# EAGLE schematic motherboard (EAGLE 8.2.2)

## Sheet 1 of 3
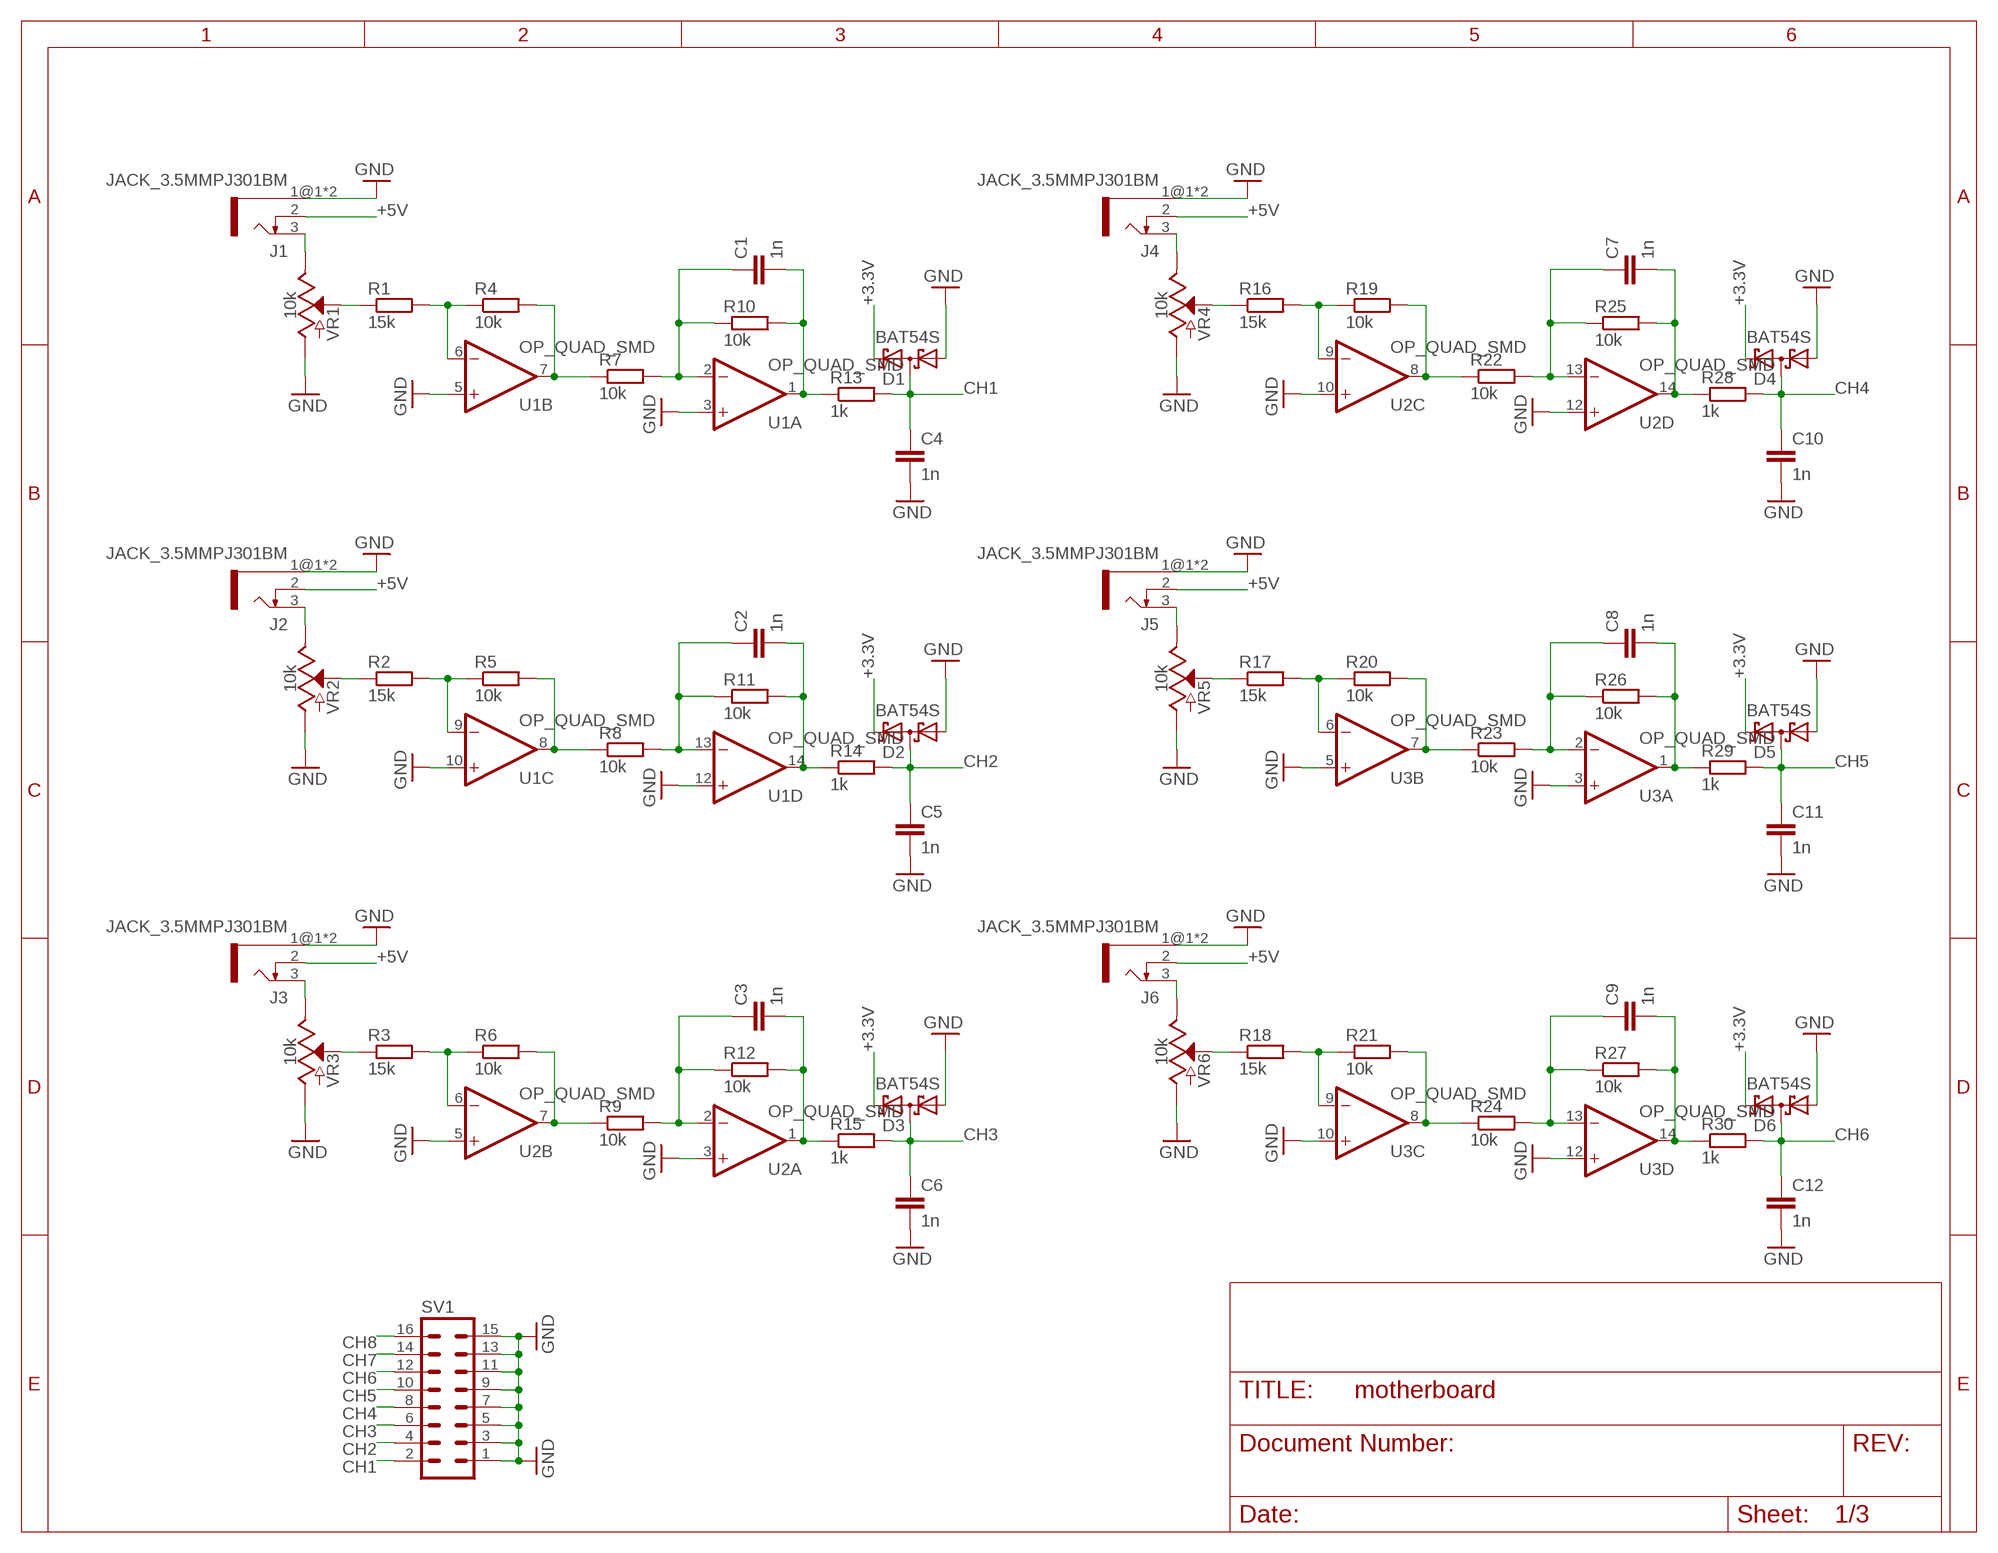
[diagram p0: schematic, sheet 1]

### Parts
C1  1n  CC0603  [C0603]
C2  1n  CC0603  [C0603]
C3  1n  CC0603  [C0603]
C4  1n  CC0603  [C0603]
C5  1n  CC0603  [C0603]
C6  1n  CC0603  [C0603]
C7  1n  CC0603  [C0603]
C8  1n  CC0603  [C0603]
C9  1n  CC0603  [C0603]
C10  1n  CC0603  [C0603]
C11  1n  CC0603  [C0603]
C12  1n  CC0603  [C0603]
D1  BAT54S  [SOT23]
D2  BAT54S  [SOT23]
D3  BAT54S  [SOT23]
D4  BAT54S  [SOT23]
D5  BAT54S  [SOT23]
D6  BAT54S  [SOT23]
J1  JACK_3.5MMPJ301BM  [PJ301BM_JACK]
J2  JACK_3.5MMPJ301BM  [PJ301BM_JACK]
J3  JACK_3.5MMPJ301BM  [PJ301BM_JACK]
J4  JACK_3.5MMPJ301BM  [PJ301BM_JACK]
J5  JACK_3.5MMPJ301BM  [PJ301BM_JACK]
J6  JACK_3.5MMPJ301BM  [PJ301BM_JACK]
R1  15k  RR0603  [R0603]
R2  15k  RR0603  [R0603]
R3  15k  RR0603  [R0603]
R4  10k  RR0603  [R0603]
R5  10k  RR0603  [R0603]
R6  10k  RR0603  [R0603]
R7  10k  RR0603  [R0603]
R8  10k  RR0603  [R0603]
R9  10k  RR0603  [R0603]
R10  10k  RR0603  [R0603]
R11  10k  RR0603  [R0603]
R12  10k  RR0603  [R0603]
R13  1k  RR0603  [R0603]
R14  1k  RR0603  [R0603]
R15  1k  RR0603  [R0603]
R16  15k  RR0603  [R0603]
R17  15k  RR0603  [R0603]
R18  15k  RR0603  [R0603]
R19  10k  RR0603  [R0603]
R20  10k  RR0603  [R0603]
R21  10k  RR0603  [R0603]
R22  10k  RR0603  [R0603]
R23  10k  RR0603  [R0603]
R24  10k  RR0603  [R0603]
R25  10k  RR0603  [R0603]
R26  10k  RR0603  [R0603]
R27  10k  RR0603  [R0603]
R28  1k  RR0603  [R0603]
R29  1k  RR0603  [R0603]
R30  1k  RR0603  [R0603]
SV1  MA08-2  [MA08-2]
U1  OP_QUAD_SMD  [SO14]
U2  OP_QUAD_SMD  [SO14]
U3  OP_QUAD_SMD  [SO14]
VR1  10k  POTENTIOMETER-PTH-9MM-1/20W-20%-KIT  [POT-PTH-ALPS-KIT]
VR2  10k  POTENTIOMETER-PTH-9MM-1/20W-20%-KIT  [POT-PTH-ALPS-KIT]
VR3  10k  POTENTIOMETER-PTH-9MM-1/20W-20%-KIT  [POT-PTH-ALPS-KIT]
VR4  10k  POTENTIOMETER-PTH-9MM-1/20W-20%-KIT  [POT-PTH-ALPS-KIT]
VR5  10k  POTENTIOMETER-PTH-9MM-1/20W-20%-KIT  [POT-PTH-ALPS-KIT]
VR6  10k  POTENTIOMETER-PTH-9MM-1/20W-20%-KIT  [POT-PTH-ALPS-KIT]

### Nets
+3.3V [power]: D1.2(C2) D2.2(C2) D3.2(C2) D4.2(C2) D5.2(C2) D6.2(C2) ; also sheet 3
+5V: J1.2 J2.2 J3.2 J4.2 J5.2 J6.2 ; also sheet 2,3
CH1: C4.1 D1.3(C1A2) R13.2 SV1.2
CH2: C5.1 D2.3(C1A2) R14.2 SV1.4
CH3: C6.1 D3.3(C1A2) R15.2 SV1.6
CH4: C10.1 D4.3(C1A2) R28.2 SV1.8
CH5: C11.1 D5.3(C1A2) R29.2 SV1.10
CH6: C12.1 D6.3(C1A2) R30.2 SV1.12
CH7: SV1.14
CH8: SV1.16
GND [ground]: C4.2 C5.2 C6.2 C10.2 C11.2 C12.2 D1.1(A1) D2.1(A1) D3.1(A1) D4.1(A1) D5.1(A1) D6.1(A1) J1.1@1 J1.1@2 J2.1@1 J2.1@2 J3.1@1 J3.1@2 J4.1@1 J4.1@2 J5.1@1 J5.1@2 J6.1@1 J6.1@2 SV1.1 SV1.3 SV1.5 SV1.7 SV1.9 SV1.11 SV1.13 SV1.15 U1.3(A:+IN) U1.5(B:+IN) U1.10(C:+IN) U1.12(D:+IN) U2.3(A:+IN) U2.5(B:+IN) U2.10(C:+IN) U2.12(D:+IN) U3.3(A:+IN) U3.5(B:+IN) U3.10(C:+IN) U3.12(D:+IN) VR1.P$1(A) VR2.P$1(A) VR3.P$1(A) VR4.P$1(A) VR5.P$1(A) VR6.P$1(A) ; also sheet 2,3
N$1: R2.1 VR2.P$2(S)
N$2: J2.3 VR2.P$3(E)
N$3: R1.2 R4.1 U1.6(B:-IN)
N$4: R4.2 R7.1 U1.7(B:OUT)
N$5: C1.1 R7.2 R10.1 U1.2(A:-IN)
N$6: C1.2 R10.2 R13.1 U1.1(A:OUT)
N$7: R1.1 VR1.P$2(S)
N$8: R2.2 R5.1 U1.9(C:-IN)
N$9: R5.2 R8.1 U1.8(C:OUT)
N$10: J1.3 VR1.P$3(E)
N$11: C2.1 R8.2 R11.1 U1.13(D:-IN)
N$12: C2.2 R11.2 R14.1 U1.14(D:OUT)
N$19: R16.2 R19.1 U2.9(C:-IN)
N$20: R19.2 R22.1 U2.8(C:OUT)
N$21: C7.1 R22.2 R25.1 U2.13(D:-IN)
N$22: C7.2 R25.2 R28.1 U2.14(D:OUT)
N$23: R16.1 VR4.P$2(S)
N$24: J4.3 VR4.P$3(E)
N$25: R3.2 R6.1 U2.6(B:-IN)
N$26: R6.2 R9.1 U2.7(B:OUT)
N$27: C3.1 R9.2 R12.1 U2.2(A:-IN)
N$28: C3.2 R12.2 R15.1 U2.1(A:OUT)
N$31: R3.1 VR3.P$2(S)
N$32: J3.3 VR3.P$3(E)
N$33: R18.2 R21.1 U3.9(C:-IN)
N$34: R21.2 R24.1 U3.8(C:OUT)
N$35: C9.1 R24.2 R27.1 U3.13(D:-IN)
N$36: C9.2 R27.2 R30.1 U3.14(D:OUT)
N$37: R18.1 VR6.P$2(S)
N$38: J6.3 VR6.P$3(E)
N$39: R17.2 R20.1 U3.6(B:-IN)
N$40: R20.2 R23.1 U3.7(B:OUT)
N$41: C8.1 R23.2 R26.1 U3.2(A:-IN)
N$42: C8.2 R26.2 R29.1 U3.1(A:OUT)
N$43: R17.1 VR5.P$2(S)
N$44: J5.3 VR5.P$3(E)

## Sheet 2 of 3
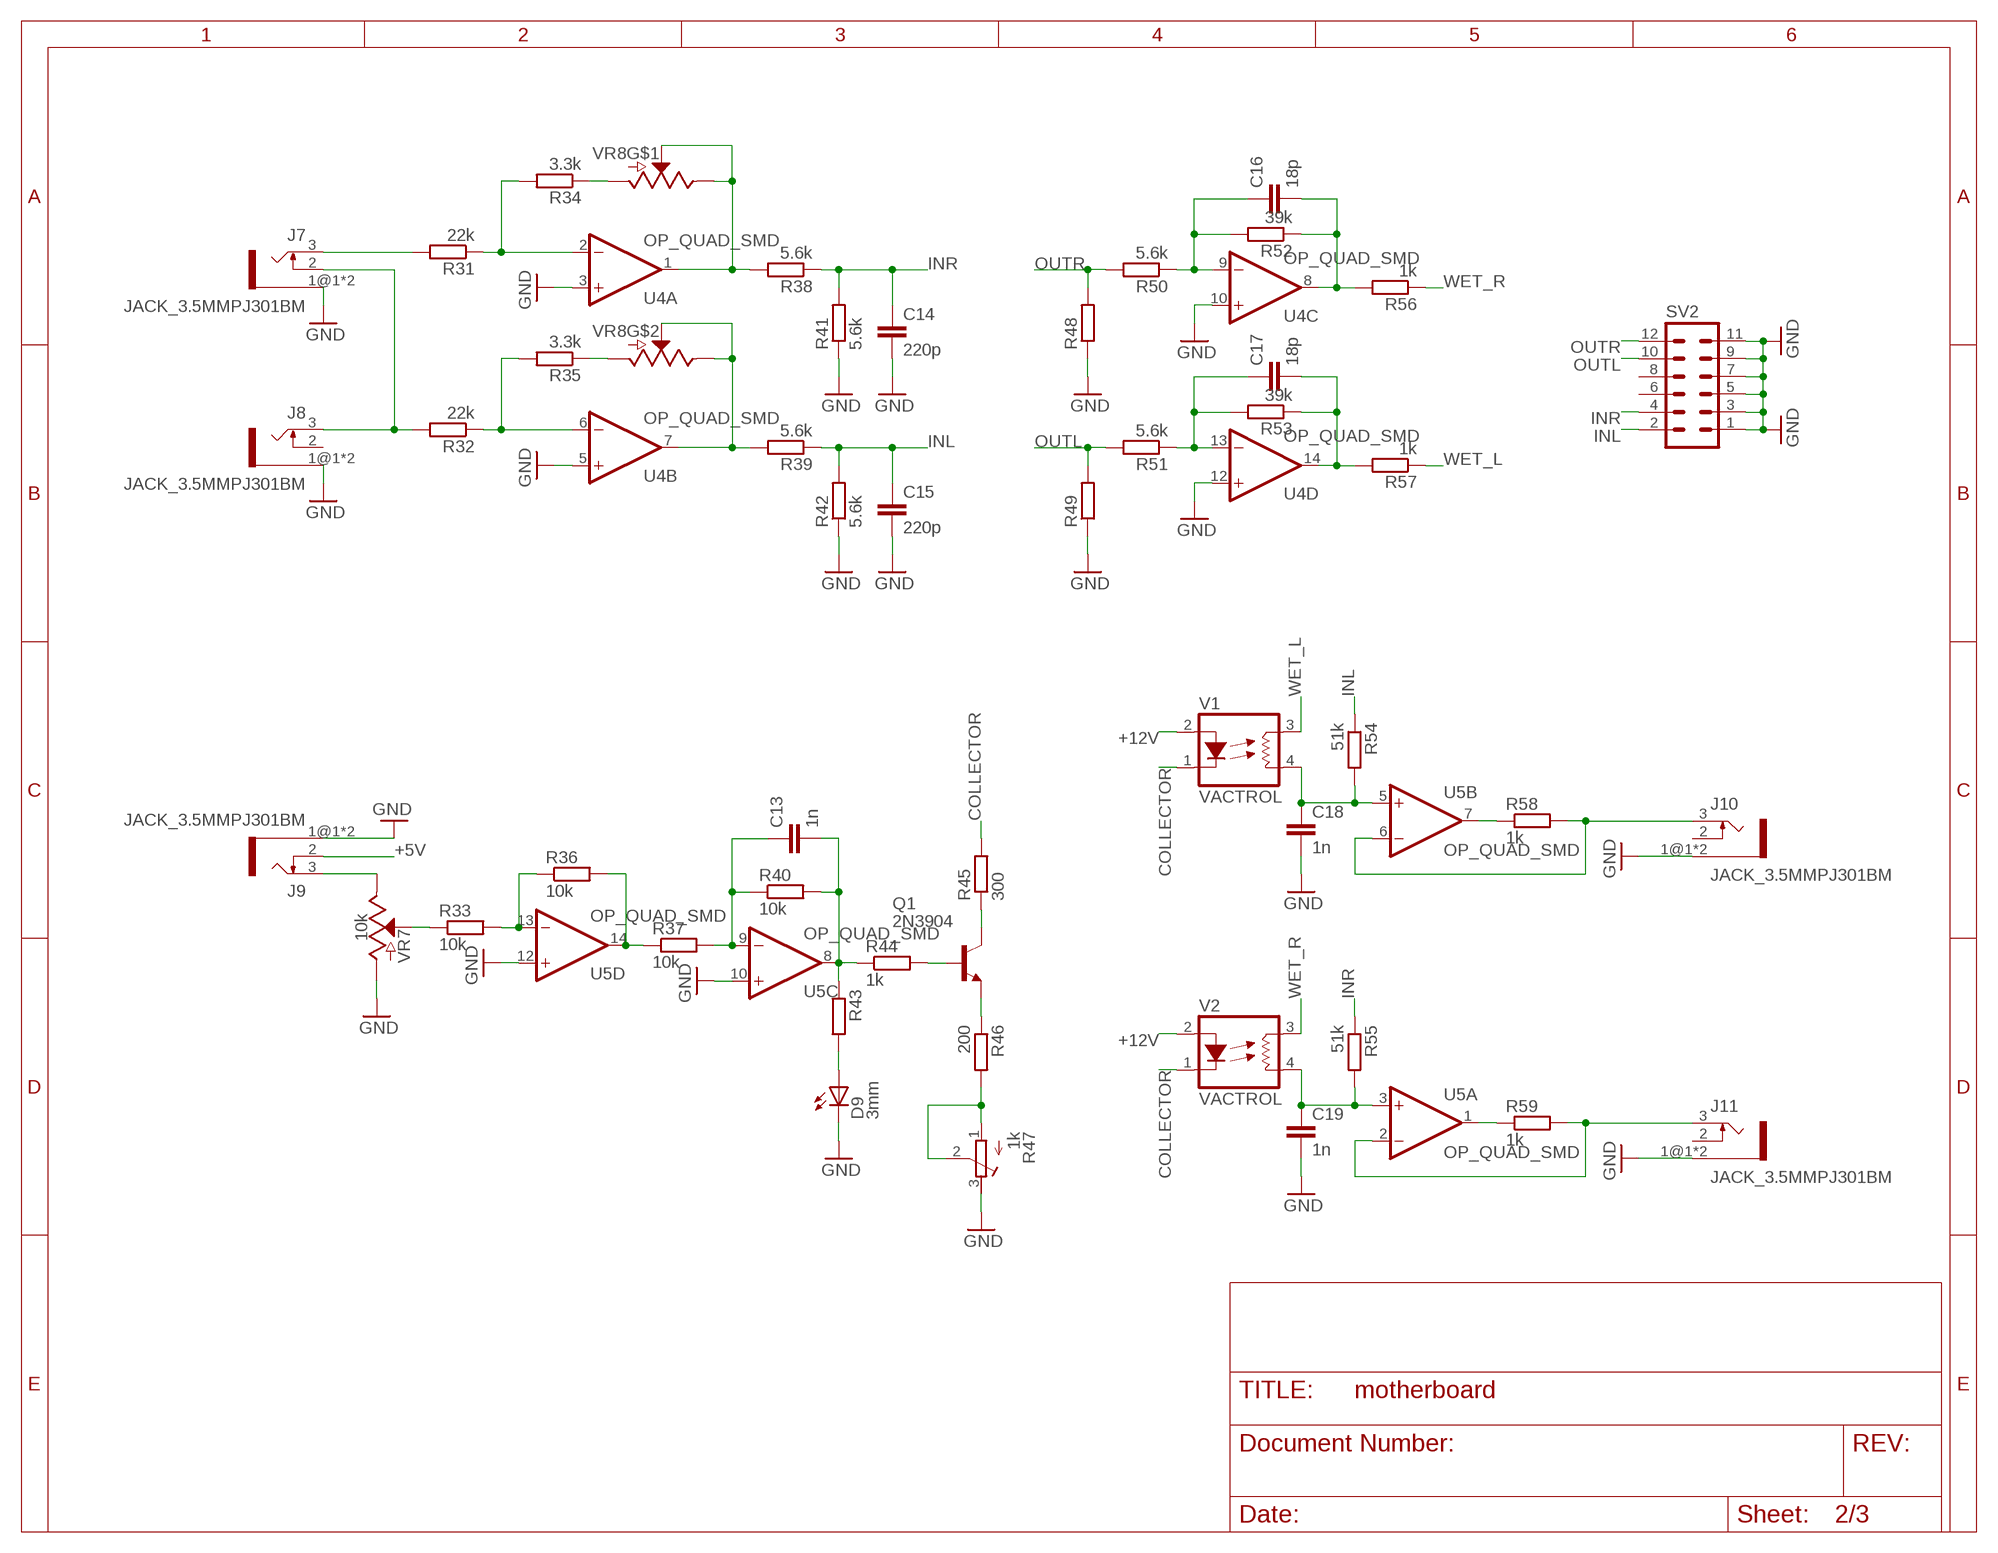
[diagram p1: schematic, sheet 2]

### Parts
C13  1n  CC0603  [C0603]
C14  220p  CC0603  [C0603]
C15  220p  CC0603  [C0603]
C16  18p  CC0603  [C0603]
C17  18p  CC0603  [C0603]
C18  1n  CC0603  [C0603]
C19  1n  CC0603  [C0603]
D9  3mm  LED3MM  [LED3MM]
J7  JACK_3.5MMPJ301BM  [PJ301BM_JACK]
J8  JACK_3.5MMPJ301BM  [PJ301BM_JACK]
J9  JACK_3.5MMPJ301BM  [PJ301BM_JACK]
J10  JACK_3.5MMPJ301BM  [PJ301BM_JACK]
J11  JACK_3.5MMPJ301BM  [PJ301BM_JACK]
Q1  2N3904  [TO92]
R31  22k  RR0603  [R0603]
R32  22k  RR0603  [R0603]
R33  10k  RR0603  [R0603]
R34  3.3k  RR0603  [R0603]
R35  3.3k  RR0603  [R0603]
R36  10k  RR0603  [R0603]
R37  10k  RR0603  [R0603]
R38  5.6k  RR0603  [R0603]
R39  5.6k  RR0603  [R0603]
R40  10k  RR0603  [R0603]
R41  5.6k  RR0603  [R0603]
R42  5.6k  RR0603  [R0603]
R43  RESISTOR10MM  [1/4W_RESISTOR]
R44  1k  RR0603  [R0603]
R45  300  RESISTOR10MM  [1/4W_RESISTOR]
R46  200  RR0603  [R0603]
R47  1k  R-TRIMM64W  [RTRIM64W]
R48  RR0603  [R0603]
R49  RR0603  [R0603]
R50  5.6k  RR0603  [R0603]
R51  5.6k  RR0603  [R0603]
R52  39k  RR0603  [R0603]
R53  39k  RR0603  [R0603]
R54  51k  RR0603  [R0603]
R55  51k  RR0603  [R0603]
R56  1k  RR0603  [R0603]
R57  1k  RR0603  [R0603]
R58  1k  RR0603  [R0603]
R59  1k  RR0603  [R0603]
SV2  MA06-2  [MA06-2]
U4  OP_QUAD_SMD  [SO14]
U5  OP_QUAD_SMD  [SO14]
V1  VACTROL  [VACTROL_4PIN_VTL5C]
V2  VACTROL  [VACTROL_4PIN_VTL5C]
VR7  10k  POTENTIOMETER-PTH-9MM-1/20W-20%-KIT  [POT-PTH-ALPS-KIT]
VR8  POTENTIOMETER_DUAL-PTH-12MM-1/20W-20%-KIT  [POT-DUAL-PTH-PANASONIC-VERT-KIT]

### Nets
+5V: J9.2 ; also sheet 1,3
+12V [power]: V1.2(LED+) V2.2(LED+) ; also sheet 3
COLLECTOR: R45.2 V1.1(LED-) V2.1(LED-)
GND [ground]: C14.2 C15.2 C18.2 C19.2 D9.K(C) J7.1@1 J7.1@2 J8.1@1 J8.1@2 J9.1@1 J9.1@2 J10.1@1 J10.1@2 J11.1@1 J11.1@2 R41.1 R42.1 R47.3(A) R48.1 R49.1 SV2.1 SV2.3 SV2.5 SV2.7 SV2.9 SV2.11 U4.3(A:+IN) U4.5(B:+IN) U4.10(C:+IN) U4.12(D:+IN) U5.10(C:+IN) U5.12(D:+IN) VR7.P$1(A) ; also sheet 1,3
INL: C15.1 R39.1 R42.2 R54.1 SV2.2
INR: C14.1 R38.1 R41.2 R55.1 SV2.4
N$13: J9.3 VR7.P$3(E)
N$14: C13.2 R40.2 R43.1 R44.1 U5.8(C:OUT)
N$15: R33.1 VR7.P$2(S)
N$16: R33.2 R36.1 U5.13(D:-IN)
N$17: R36.2 R37.1 U5.14(D:OUT)
N$18: C13.1 R37.2 R40.1 U5.9(C:-IN)
N$29: D9.A R43.2
N$30: J10.3 R58.2 U5.6(B:-IN)
N$45: R58.1 U5.7(B:OUT)
N$46: C18.1 R54.2 U5.5(B:+IN) V1.4(RES2)
N$47: Q1.3(E) R46.1
N$48: R46.2 R47.1(E) R47.2(S)
N$49: Q1.1(C) R45.1
N$51: R34.1 VR8.A1(A)
N$52: Q1.2(B) R44.2
N$53: J11.3 R59.2 U5.2(A:-IN)
N$54: R59.1 U5.1(A:OUT)
N$55: C19.1 R55.2 U5.3(A:+IN) V2.4(RES2)
N$56: R35.1 VR8.B1(A)
N$61 [ground]: J7.2 J8.3 R32.2
N$62: J7.3 R31.2
N$69: C17.1 R51.1 R53.2 U4.13(D:-IN)
N$70: C17.2 R53.1 R57.2 U4.14(D:OUT)
N$72: C16.1 R50.1 R52.2 U4.9(C:-IN)
N$73: C16.2 R52.1 R56.2 U4.8(C:OUT)
N$74: R38.2 U4.1(A:OUT) VR8.A2(S) VR8.A3(E)
N$75: R39.2 U4.7(B:OUT) VR8.B2(S) VR8.B3(E)
N$78: R31.1 R34.2 U4.2(A:-IN)
N$79: R32.1 R35.2 U4.6(B:-IN)
OUTL: R49.2 R51.2 SV2.10
OUTR: R48.2 R50.2 SV2.12
WET_L: R57.1 V1.3(RES1)
WET_R: R56.1 V2.3(RES1)
Unconnected: J8.2 J10.2 J11.2 SV2.6 SV2.8

## Sheet 3 of 3
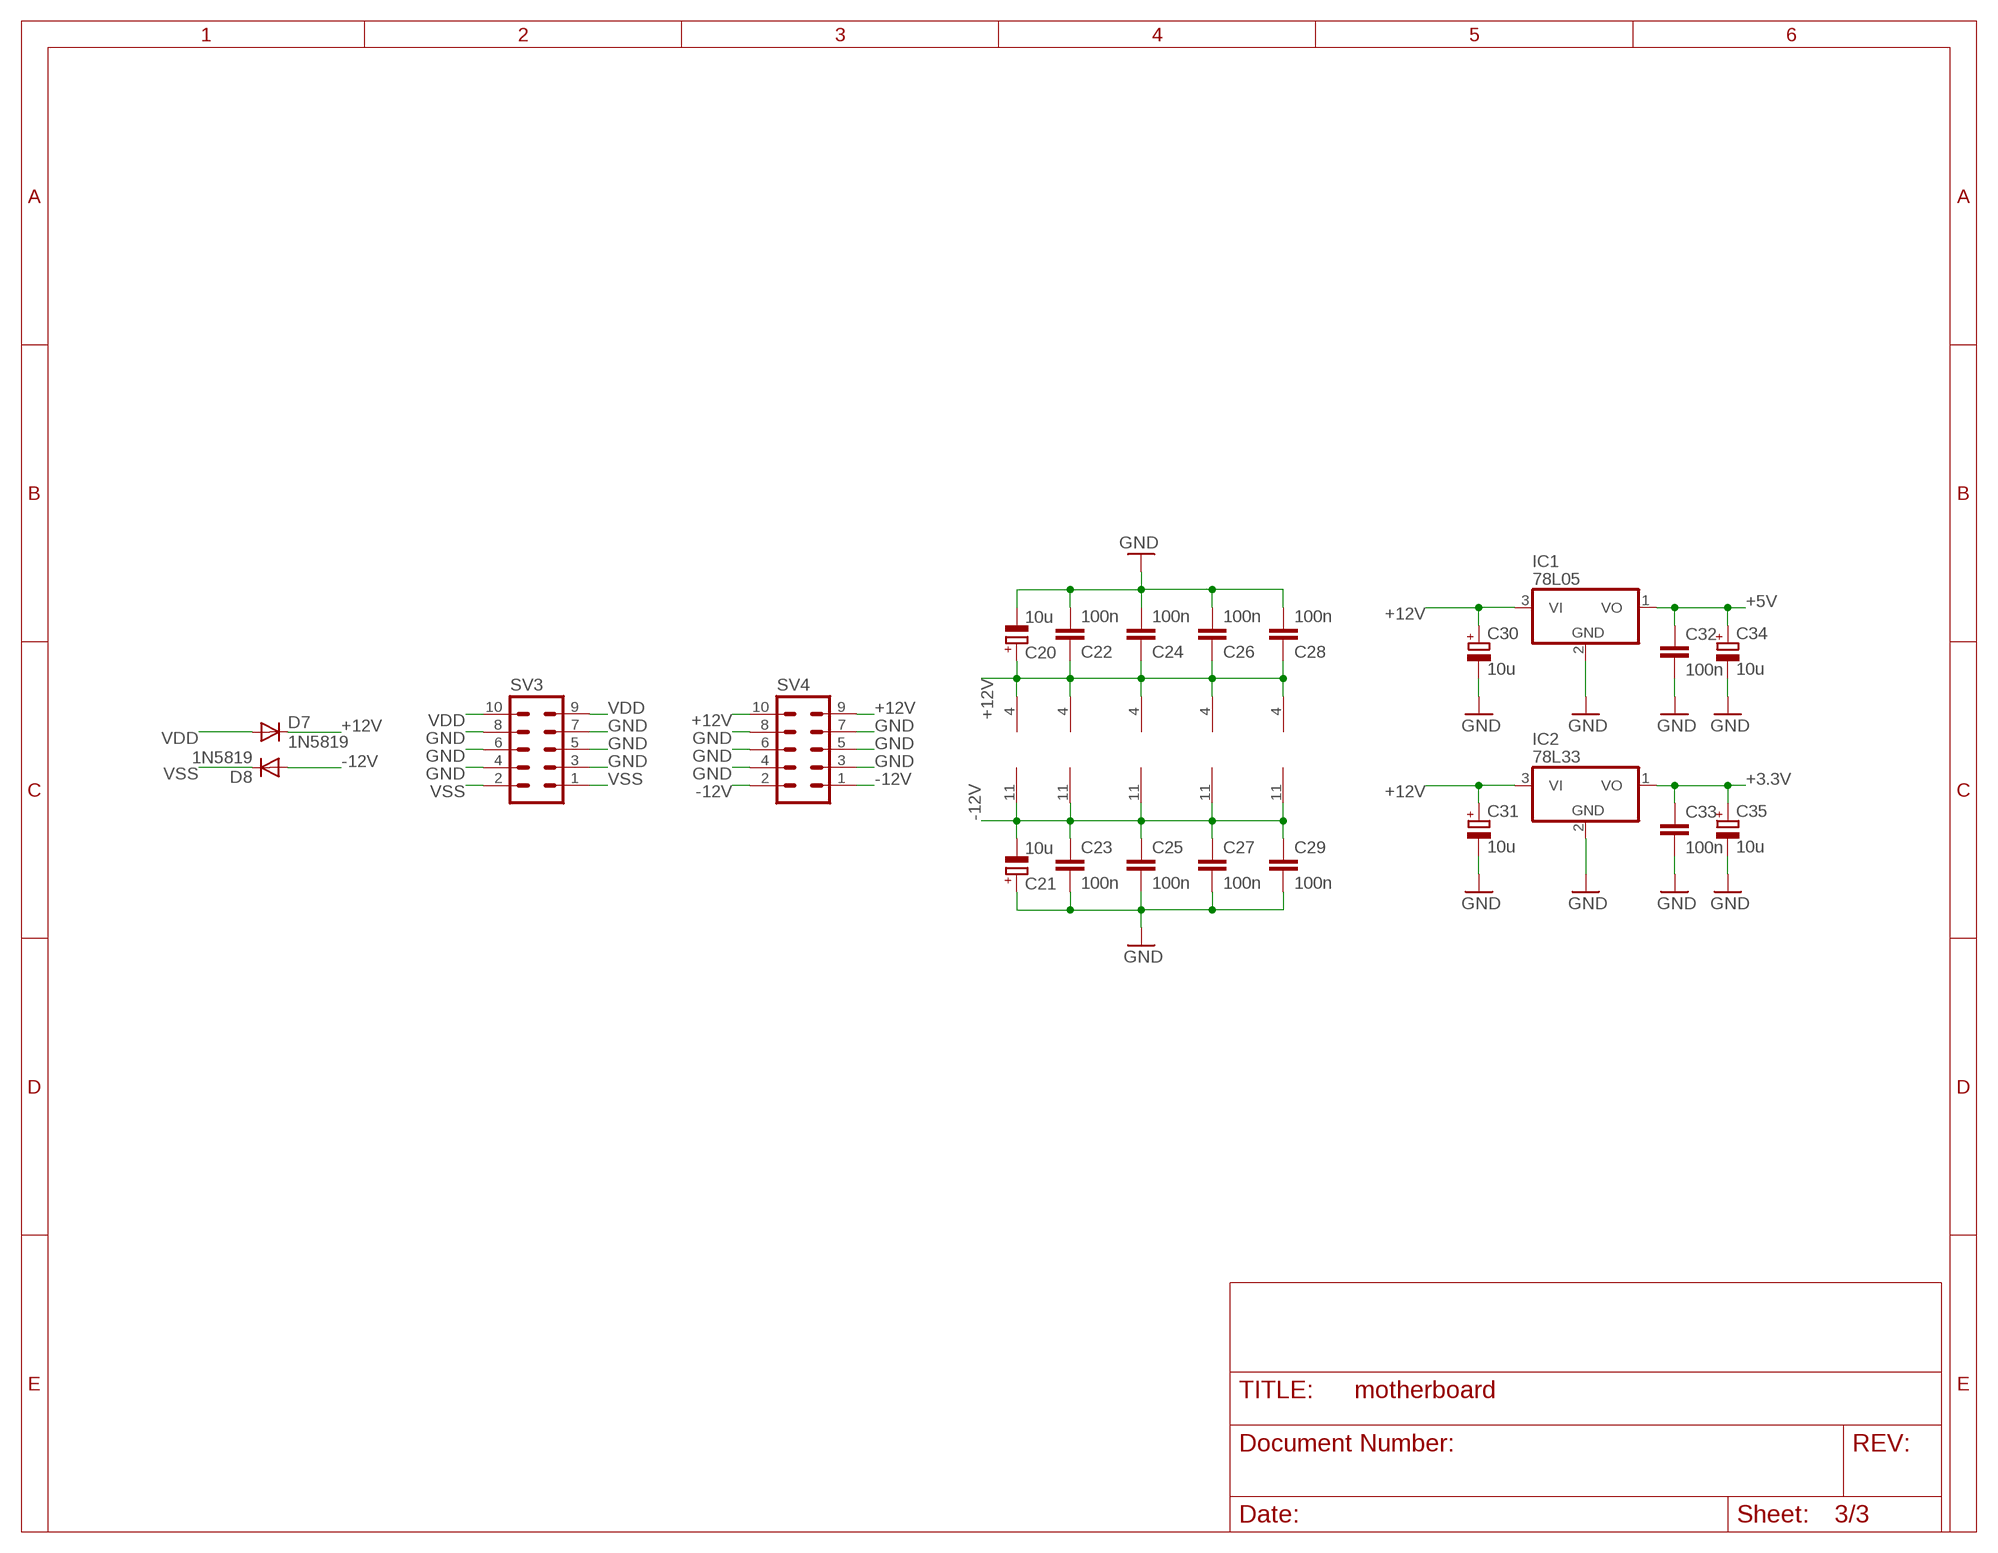
[diagram p2: schematic, sheet 3]

### Parts
C20  10u  CPOL-EUE2.5-6  [E2,5-6]
C21  10u  CPOL-EUE2.5-6  [E2,5-6]
C22  100n  C5/3.5  [C5B3.5]
C23  100n  C5/3.5  [C5B3.5]
C24  100n  C5/3.5  [C5B3.5]
C25  100n  C5/3.5  [C5B3.5]
C26  100n  C5/3.5  [C5B3.5]
C27  100n  C5/3.5  [C5B3.5]
C28  100n  C5/3.5  [C5B3.5]
C29  100n  C5/3.5  [C5B3.5]
C30  10u  CPOL-EUE2.5-6  [E2,5-6]
C31  10u  CPOL-EUE2.5-6  [E2,5-6]
C32  100n  C5/3.5  [C5B3.5]
C33  100n  C5/3.5  [C5B3.5]
C34  10u  CPOL-EUE2.5-6  [E2,5-6]
C35  10u  CPOL-EUE2.5-6  [E2,5-6]
D7  1N5819  CGRM4001-G  [SOD-123_MINI-SMA]
D8  1N5819  CGRM4001-G  [SOD-123_MINI-SMA]
IC1  78L05  78L05Z  [TO92]
IC2  78L33  78L05Z  [TO92]
SV3  MA05-2  [MA05-2]
SV4  MA05-2  [MA05-2]

### Nets
+3.3V [power]: C33.1 C35.+ IC2.1(VO) ; also sheet 1
+5V: C32.1 C34.+ IC1.1(VO) ; also sheet 1,2
+12V [power]: C20.+ C22.1 C24.1 C26.1 C28.1 C30.+ C31.+ D7.C IC1.3(VI) IC2.3(VI) SV4.9 SV4.10 U1.4(P:V+) U2.4(P:V+) U3.4(P:V+) U4.4(P:V+) U5.4(P:V+) ; also sheet 2
-12V: C21.- C23.1 C25.1 C27.1 C29.1 D8.A SV4.1 SV4.2 U1.11(P:V-) U2.11(P:V-) U3.11(P:V-) U4.11(P:V-) U5.11(P:V-)
GND [ground]: C20.- C21.+ C22.2 C23.2 C24.2 C25.2 C26.2 C27.2 C28.2 C29.2 C30.- C31.- C32.2 C33.2 C34.- C35.- IC1.2(GND) IC2.2(GND) SV3.3 SV3.4 SV3.5 SV3.6 SV3.7 SV3.8 SV4.3 SV4.4 SV4.5 SV4.6 SV4.7 SV4.8 ; also sheet 1,2
VDD [power]: D7.A SV3.9 SV3.10
VSS [power]: D8.C SV3.1 SV3.2

## Library data of the parts
C1-C19 = eagle-ltspice:C: CAPACITOR, European symbol; SPICEMODEL: NONE; SPICEPREFIX: C
C20 C21 C30 C31 C34 C35 = rcl:CPOL-EU: POLARIZED CAPACITOR, European symbol
C22-C29 C32 C33 = capacitor-wima:C: CAPACITOR naming: grid - package width
D1-D6 = diode:BAT54S: Schottky Diodes Pin connection corrected 2011-05-04 Source: Fairchild .. BAT54.pdf
D7 D8 = diode:CGRM400*-G: Molded plasitc,JEDEC SOD-123/Mini SMA Source: Comchip CGRM4001-G.pdf
D9 = led:LED: LED OSRAM: - CHIPLED LG R971, LG N971, LY N971, LG Q971, LY Q971, LO R971, LY R971 LH N974, LH R974 LS Q976, LO Q976, LY Q976 LO Q996 - Hyper CHIPLED LW Q18S LB Q993, LB Q99A, LB R99A - SideLED LS A670, LO A670, LY A670, LG A670, LP A670 LB A673, LV A673, LT A673, LW A673 LH A674 LY A675 LS A676, LA A676, LO A676, LY A676, LW A676 LS A679, LY A679, LG A679 - Hyper Micro SIDELED® LS Y876, LA Y876, LO Y876, LY Y876 LT Y87S - SmartLED LW L88C, LW L88S LB L89C, LB L89S, LG L890 LS L89K, LO L89K, LY L89K LS L896, LA L896, LO L896, LY L896 - TOPLED LS T670, LO T670, LY T670, LG T670, LP T670 LSG T670, LSP T670, LSY T670, LOP T670, LYG T670 LG T671, LOG T671, LSG T671 LB T673, LV T673, LT T673, LW T673 LH T674 LS T676, LA T676, LO T676, LY T676, LB T676, LH T676, LSB T676, LW T676 LB T67C, LV T67C, LT T67C, LS T67K, LO T67K, LY T67K, LW E67C LS E67B, LA E67B, LO E67B, LY E67B, LB E67C, LV E67C, LT E67C LW T67C LS T679, LY T679, LG T679 LS T770, LO T770, LY T770, LG T770, LP T770 LB T773, LV T773, LT T773, LW T773 LH T774 LS E675, LA E675, LY E675, LS T675 LS T776, LA T776, LO T776, LY T776, LB T776 LHGB T686 LT T68C, LB T68C - Hyper Mini TOPLED® LB M676 - Mini TOPLED Santana® LG M470 LS M47K, LO M47K, LY M47K Source: http://www.osram.convergy.de LUXEON: - LUMILED® LXK2-PW12-R00, LXK2-PW12-S00, LXK2-PW14-U00, LXK2-PW14-V00 LXK2-PM12-R00, LXK2-PM12-S00, LXK2-PM14-U00 LXK2-PE12-Q00, LXK2-PE12-R00, LXK2-PE12-S00, LXK2-PE14-T00, LXK2-PE14-U00 LXK2-PB12-K00, LXK2-PB12-L00, LXK2-PB12-M00, LXK2-PB14-N00, LXK2-PB14-P00, LXK2-PB14-Q00 LXK2-PR12-L00, LXK2-PR12-M00, LXK2-PR14-Q00, LXK2-PR14-R00 LXK2-PD12-Q00, LXK2-PD12-R00, LXK2-PD12-S00 LXK2-PH12-R00, LXK2-PH12-S00 LXK2-PL12-P00, LXK2-PL12-Q00, LXK2-PL12-R00 Source: www.luxeon.com KINGBRIGHT: KA-3528ASYC Source: www.kingbright.com
IC1 IC2 = linear:78*: Positive VOLTAGE REGULATOR Source: http://cache.national.com/ds/LM/LM78L05.pdf http://www.fairchildsemi.com/ds/LM/LM7805.pdf
J1-J11 = kweiwen:JACK_3.5MM
Q1 = transistor:2N3904: NPN TRANSISTOR
R1-R42 R44 R46 R48-R59 = eagle-ltspice:R: RESISTOR, European symbol; SPICEMODEL: NONE; SPICEPREFIX: R
R43 R45 = kweiwen:*RESISTOR*: Standard resistor, various versions
R47 = RepRapjr:R-TRIMM: Trimm resistor
SV1 = con-lstb:MA08-2: PIN HEADER; OC_FARNELL: unknown; OC_NEWARK: unknown
SV2 = con-lstb:MA06-2: PIN HEADER; OC_FARNELL: unknown; OC_NEWARK: unknown
SV3 SV4 = con-lstb:MA05-2: PIN HEADER; OC_FARNELL: unknown; OC_NEWARK: unknown
U1-U5 = kweiwen:OP_QUAD: Generic Quad Op Amp
V1 V2 = kweiwen:VACTROL: 4 Pin Vactrol Resistive Photocoupler
VR1-VR7 = kweiwen:POTENTIOMETER: Potentiometer (Pot) Three-terminal potentiometers, with an adjustable wiper and two adjustable resistors. A pot can be used to create a configurable voltage divider, or as a variable resistor. Variants ALPS_POT and ALPS_POT_KIT - PTH, breadboard compatible, 9mm square pots Rotary Potentiometer - Linear (10k ohm) <https://www.sparkfun.com/products/9288> (COM-09288) The KIT variant exposes copper on only one side of the PTH pad, so the part can only be assembled on one side of the PCB. Useful for beginner soldering kits.; PROD_ID: RES-09177; SF_SKU: COM-09288
VR8 = kweiwen:POTENTIOMETER_DUAL: Potentiometer (Pot) Dual-Gang Three-terminal potentiometers, with an adjustable wiper and two adjustable resistors. A pot can be used to create a configurable voltage divider, or as a variable resistor. This is a dua-gang pot - it includes two separate circuits, both controlled by one wiper. Variants PTH-12MM and PTH-12MM-KIT - 12mm Square, PTH Vertical Pots Used on the SparkFun SparkPunk Sound Kit <https://www.sparkfun.com/products/11177> (filter control) The KIT variant exposes copper on only one side of the PTH pad, so the part can only be assembled on one side of the PCB. Useful for beginner soldering kits.; PROD_ID: RES-11897

## Net classes
0 default: width 0.254 mm
1 power: width 0.305 mm
2 ground: width 0.406 mm